# Altium schematic sheet Supply.SchDoc
size A; SheetNumber: 2; SheetTotal: 5
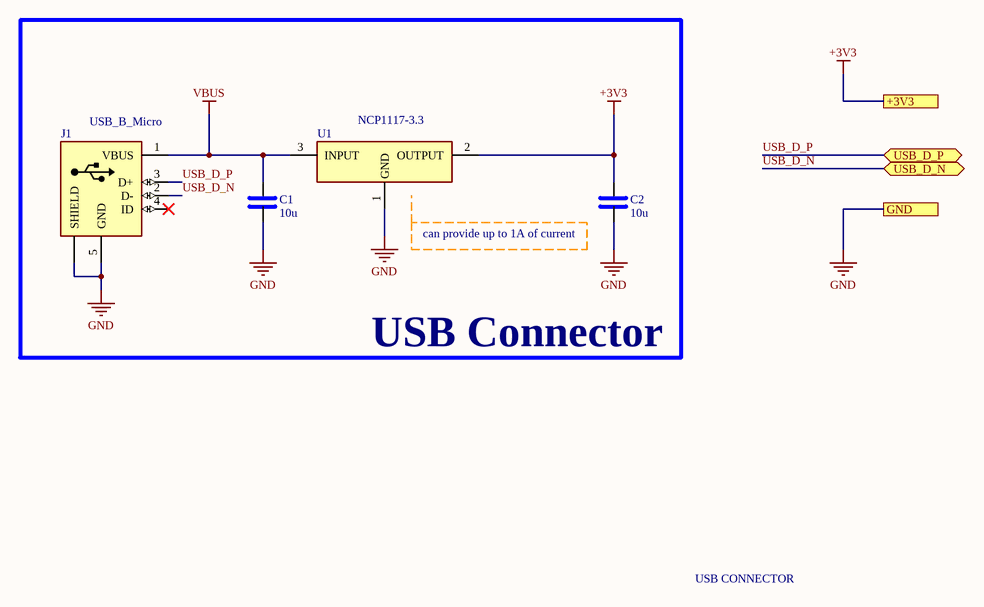
[diagram p0: Supply.SchDoc]

## Parts
C1  10u  [VJ0805]
C2  10u  [VJ0805]
J1  USB_B_Micro  [MOLEX_1050170002]
U1  NCP1117-3.3  [VREG_NCP1117STAT3]

## Ports
+3V3 (see Master[1C], Connectors[3B], Flash[4B], MCU[1A]), GND (see Master[1C], Connectors[3C], Flash[4C], MCU[1B]), USB_D_N (bidir, see Master[2C], MCU[4C]), USB_D_P (bidir, see Master[2C], MCU[4C])

## Nets
+3V3: C2.2 U1.2(OUTPUT) ; port +3V3
GND: C1.1 C2.1 J1.5(GND) J1.SH(SHIELD) U1.1(GND) ; port GND
VBUS: C1.2 J1.1(VBUS) U1.3(INPUT)
USB_D_N: J1.2(D-) ; port USB_D_N
USB_D_P: J1.3(D+) ; port USB_D_P

Not connected (* = marked no-connect by the designer): J1 4(ID)*

## Notes on the sheet
- (near C2) can provide up to 1A of current
- USB Connector
- USB CONNECTOR

## Library data of the parts
C1 C2 = 0805 SMD Capacitor: Ceramic Capacitor, Multilayer, Ceramic, 25V, 10% +Tol, 10% -Tol, X5R, 15% TC, 10uF, Surface Mount, 0805; Manufacturer: Murata; Manufacturer Part Number: GRM21BR61E106KA73K; Multilayer: Yes; ComponentLink1Description: Link; ComponentLink1URL: *; Supplier: Future Electronics; Supplier Part Number: 9092991; RoHS: Yes; Category: Ceramic Capacitors; Stock: 40000; Pricing: 10000=0.0248, 20000=0.0245, 30000=0.0242, 40000=0.0241, 50000=0.0236 (USD); Mounting Technology: Surface Mount; Pins: 2; Dielectric Material: Ceramic; Package Shape: Rectangular; Case/Package: 0805; Terminal Finish: Nickel; Min Operating Temperature: -55°C; Max Operating Temperature: 85°C; JESD-609 Code: e3; Value: 10uF; Capacitor Type: Ceramic; Tolerance  (fill in as +-): 10%; Package Style: SMTMeter; Packaging: Tape and Reel; Tolerance (fill in as +-): 10%; Rated DC Voltage (URdc): 25V; Temperature Characteristics Code: X5R; Termination: Wraparound; Length: 2mm; Width: 1.25mm; Height: 1.25mm; Reach SVHC Compliant: Yes; RoHS Compliant: Yes; ComponentLink2URL: https://datasheet.ciiva.com:443/pdfs/VipMasterIC/IC/MURE/MURE-S-A0004349797/MURE-S-A0004361627-1.pdf?src-supplier=IHS+Markit; ComponentLink2Description: https://datasheet.ciiva.com:443/pdfs/VipMasterIC/IC/MURE/MURE-S-A0004349797/MURE-S-A0004361627-1.pdf?src-supplier=IHS+Markit; ComponentLink3URL: http://www.mouser.com/ds/2/281/c02e-2905.pdf?src-supplier=Mouser; ComponentLink3Description: http://www.mouser.com/ds/2/281/c02e-2905.pdf?src-supplier=Mouser; ComponentLink4URL: https://datasheet.octopart.com/GRM21BR61E106KA73K-Murata-datasheet-149523495.pdf?src-supplier=Newark; ComponentLink4Description: https://datasheet.octopart.com/GRM21BR61E106KA73K-Murata-datasheet-149523495.pdf?src-supplier=Newark; ComponentLink5URL: https://datasheet.octopart.com/GRM21BR61E106KA73K-Murata-datasheet-99353849.pdf?src-supplier=Future+Electronics; ComponentLink5Description: https://datasheet.octopart.com/GRM21BR61E106KA73K-Murata-datasheet-99353849.pdf?src-supplier=Future+Electronics; ComponentLink6URL: http://search.murata.co.jp/Ceramy/image/img/A01X/G101/ENG/GRM21BR61E106KA73-01.pdf?src-supplier=Digikey; ComponentLink6Description: http://search.murata.co.jp/Ceramy/image/img/A01X/G101/ENG/GRM21BR61E106KA73-01.pdf?src-supplier=Digikey; ComponentLink7URL: https://search.murata.co.jp/Ceramy/image/img/A01X/G101/ENG/GRM21BR61E106KA73-01.pdf?src-supplier=Digikey; ComponentLink7Description: https://search.murata.co.jp/Ceramy/image/img/A01X/G101/ENG/GRM21BR61E106KA73-01.pdf?src-supplier=Digikey; ComponentLink8URL: https://datasheet.octopart.com/GRM21BR61E106KA73K-Murata-datasheet-165579666.pdf?src-supplier=TME; ComponentLink8Description: https://datasheet.octopart.com/GRM21BR61E106KA73K-Murata-datasheet-165579666.pdf?src-supplier=TME
J1 = USB_B_Micro: Micro-USB B Receptacle, Bottom Mount, Surface Mount with Solder Tabs, Lead-Free; pin to pad: SH>SH1+SH2+SH3+SH4+SH5+SH6; MF: Molex; MP: 1050170002; SnapEDA_Link: https://www.snapeda.com/parts/1050170002/Molex/view-part/?ref=snap; Package: None; Value: *; Check_prices: https://www.snapeda.com/parts/1050170002/Molex/view-part/?ref=eda
U1 = NCP1117-3.3: Linear Voltage Regulator IC Positive Adjustable 1 Output 1A SOT-223; pin to pad: 2>2+4; MF: ON Semiconductor; MP: NCP1117STAT3; Value: *; Package: None; Purchase-URL: https://pricing.snapeda.com/search/part/NCP1117STAT3/?ref=eda; SnapEDA_Link: https://www.snapeda.com/parts/NCP1117STAT3/Onsemi/view-part/?ref=snap; Price: None; Check_prices: https://www.snapeda.com/parts/NCP1117STAT3/Onsemi/view-part/?ref=eda; Availability: In Stock